# Altium schematic sheet DC_motor_driver.SchDoc
size A4; PageSetup: Record=PageOptions|CenterHorizontal=True|CenterVertical=True|PrintScale=1.00|XCorrection=1.00|YCorrection=1.00|PrintKind=0|BorderSize=5000000|LeftOffset=0|BottomOffset=0|Orientation=2|PaperLength=1000|PaperWidth=1000|Scale=100|PaperSource=7|PrintQuality=-3|MediaType=1|DitherType=10|PrintScaleMode=1|PaperKind=A4|PaperIndex=9
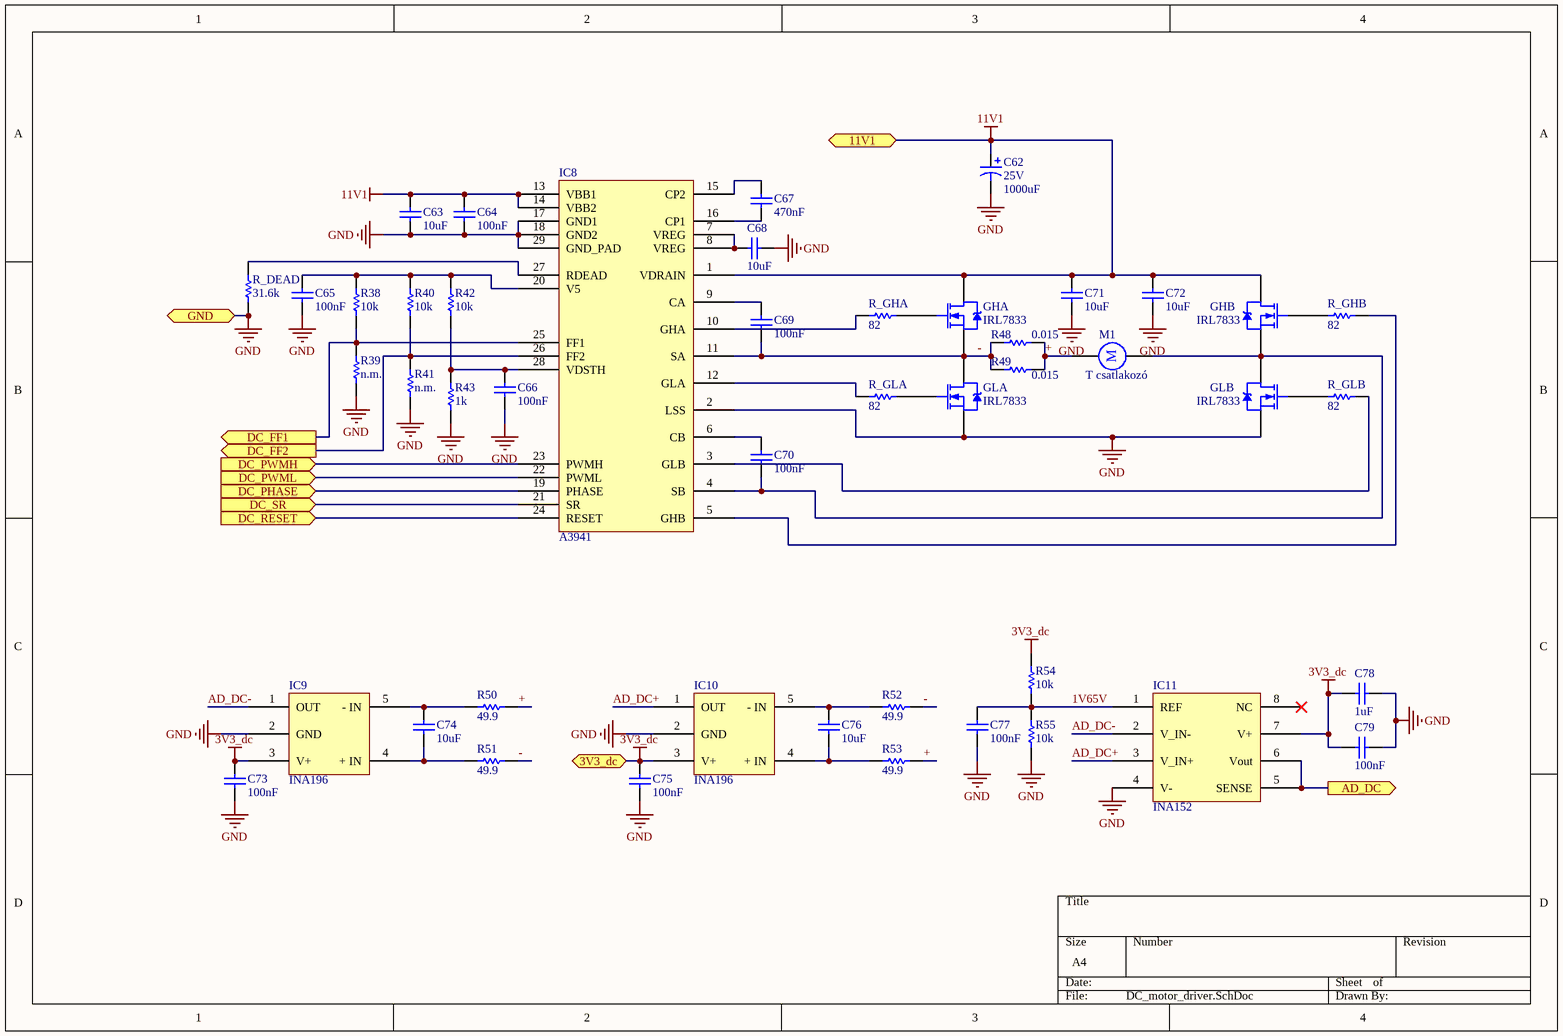
[diagram p0: DC_motor_driver.SchDoc]

## Parts
C62  25V  value 1000uF  [power_cap_13mm]
C63  value 10uF  [FP_1206_CAP_125]  (hidden comment: Cap)
C64  value 100nF  [FP_0603_CAP_080]  (hidden comment: Cap)
C65  value 100nF  [FP_0603_CAP_080]  (hidden comment: Cap)
C66  value 100nF  [FP_0603_CAP_080]  (hidden comment: Cap)
C67  value 470nF  [FP_0603_CAP_080]  (hidden comment: Cap)
C68  value 10uF  [FP_1206_CAP_125]  (hidden comment: Cap)
C69  value 100nF  [FP_0603_CAP_080]  (hidden comment: Cap)
C70  value 100nF  [FP_0603_CAP_080]  (hidden comment: Cap)
C71  value 10uF  [FP_1206_CAP_125]  (hidden comment: Cap)
C72  value 10uF  [FP_1206_CAP_125]  (hidden comment: Cap)
C73  value 100nF  [FP_0603_CAP_080]  (hidden comment: Cap)
C74  value 10uF  [FP_0603_CAP_080]  (hidden comment: Cap)
C75  value 100nF  [FP_0603_CAP_080]  (hidden comment: Cap)
C76  value 10uF  [FP_0603_CAP_080]  (hidden comment: Cap)
C77  value 100nF  [FP_0603_CAP_080]  (hidden comment: Cap)
C78  value 1uF  [FP_0603_CAP_080]  (hidden comment: Cap)
C79  value 100nF  [FP_0603_CAP_080]  (hidden comment: Cap)
GHA  IRL7833  [TO220AB]
GHB  IRL7833  [TO220AB]
GLA  IRL7833  [TO220AB]
GLB  IRL7833  [TO220AB]
IC8  A3941  [TSSOP28_thermal_pad]
IC9  INA196  [FP_SOT23-5]
IC10  INA196  [FP_SOT23-5]
IC11  INA152  [MSOP-MS8_M]
M1  T csatlakozó  [T-csatlakozo]
R38  value 10k  [FP_0603_CAP_080]  (hidden comment: Res1)
R39  value n.m.  [FP_0603_CAP_080]  (hidden comment: Res1)
R40  value 10k  [FP_0603_RES]  (hidden comment: Res1)
R41  value n.m.  [FP_0603_RES]  (hidden comment: Res1)
R42  value 10k  [FP_0603_CAP_080]  (hidden comment: Res1)
R43  value 1k  [FP_0603_RES]  (hidden comment: Res1)
R48  value 0.015  [RES_2512]  (hidden comment: Res1)
R49  value 0.015  [RES_2512]  (hidden comment: Res1)
R50  value 49.9  [FP_0603_RES]  (hidden comment: Res1)
R51  value 49.9  [FP_0603_RES]  (hidden comment: Res1)
R52  value 49.9  [FP_0603_RES]  (hidden comment: Res1)
R53  value 49.9  [FP_0603_RES]  (hidden comment: Res1)
R54  value 10k  [FP_0603_RES]  (hidden comment: Res1)
R55  value 10k  [FP_0603_RES]  (hidden comment: Res1)
R_DEAD  value 31.6k  [FP_0603_RES]  (hidden comment: 1us)
R_GHA  value 82  [FP_0603_RES]  (hidden comment: Res1)
R_GHB  value 82  [FP_0603_RES]  (hidden comment: Res1)
R_GLA  value 82  [FP_0603_RES]  (hidden comment: Res1)
R_GLB  value 82  [FP_0603_RES]  (hidden comment: Res1)

## Ports
3V3_dc, 11V1, AD_DC (out), DC_FF1 (out), DC_FF2 (out), DC_PHASE (in), DC_PWMH (in), DC_PWML (in), DC_RESET (in), DC_SR (in), GND

## Nets
3V3_dc: C73.2 C75.2 C78.1 C79.1 IC9.3(V+) IC10.3(V+) IC11.7(V+) R54.2 ; port 3V3_dc
11V1: C62.1 C63.2 C64.2 C71.1 C72.1 GHA.2(D) GHB.2(D) IC8.1(VDRAIN) IC8.13(VBB1) IC8.14(VBB2) ; port 11V1
GND: C62.2 C63.1 C64.1 C65.1 C66.1 C68.1 C71.2 C72.2 C73.1 C75.1 C77.1 C78.2 C79.2 GLA.3(S) GLB.3(S) IC8.2(LSS) IC8.17(GND1) IC8.18(GND2) IC8.29(GND_PAD) IC9.2(GND) IC10.2(GND) IC11.4(V-) R39.1 R41.1 R43.1 R55.1 R_DEAD.1 ; port GND
1V65V: C77.2 IC11.1(REF) R54.1 R55.2
+: M1.1 R48.2 R49.2 R50.2 R53.2
-: C69.2 GHA.3(S) GLA.2(D) IC8.11(SA) R48.1 R49.1 R51.2 R52.2
AD_DC: IC11.5(SENSE) IC11.6(Vout) ; port AD_DC
AD_DC+: IC10.1(OUT) IC11.3(V_IN+)
AD_DC-: IC9.1(OUT) IC11.2(V_IN-)
DC_FF1: IC8.25(FF1) R38.1 R39.2 ; port DC_FF1
DC_FF2: IC8.26(FF2) R40.1 R41.2 ; port DC_FF2
DC_PHASE: IC8.19(PHASE) ; port DC_PHASE
DC_PWMH: IC8.23(PWMH) ; port DC_PWMH
DC_PWML: IC8.22(PWML) ; port DC_PWML
DC_RESET: IC8.24(RESET) ; port DC_RESET
DC_SR: IC8.21(SR) ; port DC_SR
NetC65_2: C65.2 IC8.20(V5) R38.2 R40.2 R42.2
NetC66_2: C66.2 IC8.28(VDSTH) R42.1 R43.2
NetC67_1: C67.1 IC8.16(CP1)
NetC67_2: C67.2 IC8.15(CP2)
NetC68_2: C68.2 IC8.7(VREG) IC8.8(VREG)
NetC69_1: C69.1 IC8.9(CA)
NetC70_1: C70.1 IC8.6(CB)
NetC70_2: C70.2 GHB.3(S) GLB.2(D) IC8.4(SB) M1.2
NetC74_1: C74.1 IC9.4(+_IN) R51.1
NetC74_2: C74.2 IC9.5(-_IN) R50.1
NetC76_1: C76.1 IC10.4(+_IN) R53.1
NetC76_2: C76.2 IC10.5(-_IN) R52.1
NetGHA_1: GHA.1(G) R_GHA.1
NetGHB_1: GHB.1(G) R_GHB.2
NetGLA_1: GLA.1(G) R_GLA.1
NetGLB_1: GLB.1(G) R_GLB.2
NetIC8_3: IC8.3(GLB) R_GLB.1
NetIC8_5: IC8.5(GHB) R_GHB.1
NetIC8_10: IC8.10(GHA) R_GHA.2
NetIC8_12: IC8.12(GLA) R_GLA.2
NetIC8_27: IC8.27(RDEAD) R_DEAD.2

Not connected (* = marked no-connect by the designer): IC11 8(NC)*

## Notes on the sheet
- (in symbol Motor) M

## Library data of the parts
C62 = Cap Pol1: Polarized Capacitor (Radial); Published: 8-Jun-2000; LatestRevisionDate: 17-Jul-2002; LatestRevisionNote: Re-released for DXP Platform.; PackageReference: RB7.6-15; Publisher: Altium Limited; PackageDescription: Polarized Capacitor (Radial); 2 Leads
C63-C79 = Cap: Capacitor; Published: 8-Jun-2000; LatestRevisionDate: 17-Jul-2002; LatestRevisionNote: Re-released for DXP Platform.; PackageReference: RAD-0.3; Publisher: Altium Limited; PackageDescription: Radial Cap, Thru-Hole; 2 Leads; 0.3 in Pin Spacing
GHA GHB GLA GLB = NMOS-2: N-Channel Power MOSFET; Note: Pin 2 is electrically connected to pin 4.; Published: 8-Jun-2000; LatestRevisionDate: 17-Jul-2002; LatestRevisionNote: Re-released for DXP Platform.; DatasheetVersion: PD-9.814; PackageVersion: Feb-1997; PackageReference: TO-220AB; Publisher: Altium Limited; PackageDescription: TO, Thru-Hole, Vertical, Heatsink Mounted; 3 In-Line Leads; Pitch 2.54 mm; ComponentLink1Description: Manufacturer Link; ComponentLink1URL: http://www.irf.com/
M1 = Motor: Motor, General Kind; Published: 24-Mar-1999; LatestRevisionDate: 17-Jul-2002; LatestRevisionNote: Re-released for DXP Platform.; PackageReference: RB5-10.5; Publisher: Altium Limited; PackageDescription: Capacitor (Radial); 2 Leads
R38-R43 R48-R55 R_DEAD R_GHA R_GHB R_GLA R_GLB = Res1: Resistor; Published: 8-Jun-2000; LatestRevisionDate: 17-Jul-2002; LatestRevisionNote: Re-released for DXP Platform.; PackageReference: AXIAL-0.3; Publisher: Altium Limited; PackageDescription: Axial Device, Thru-Hole; 2 Leads; 0.3 in Pin Spacing